# Altium schematic sheet MEM.SchDoc
size B
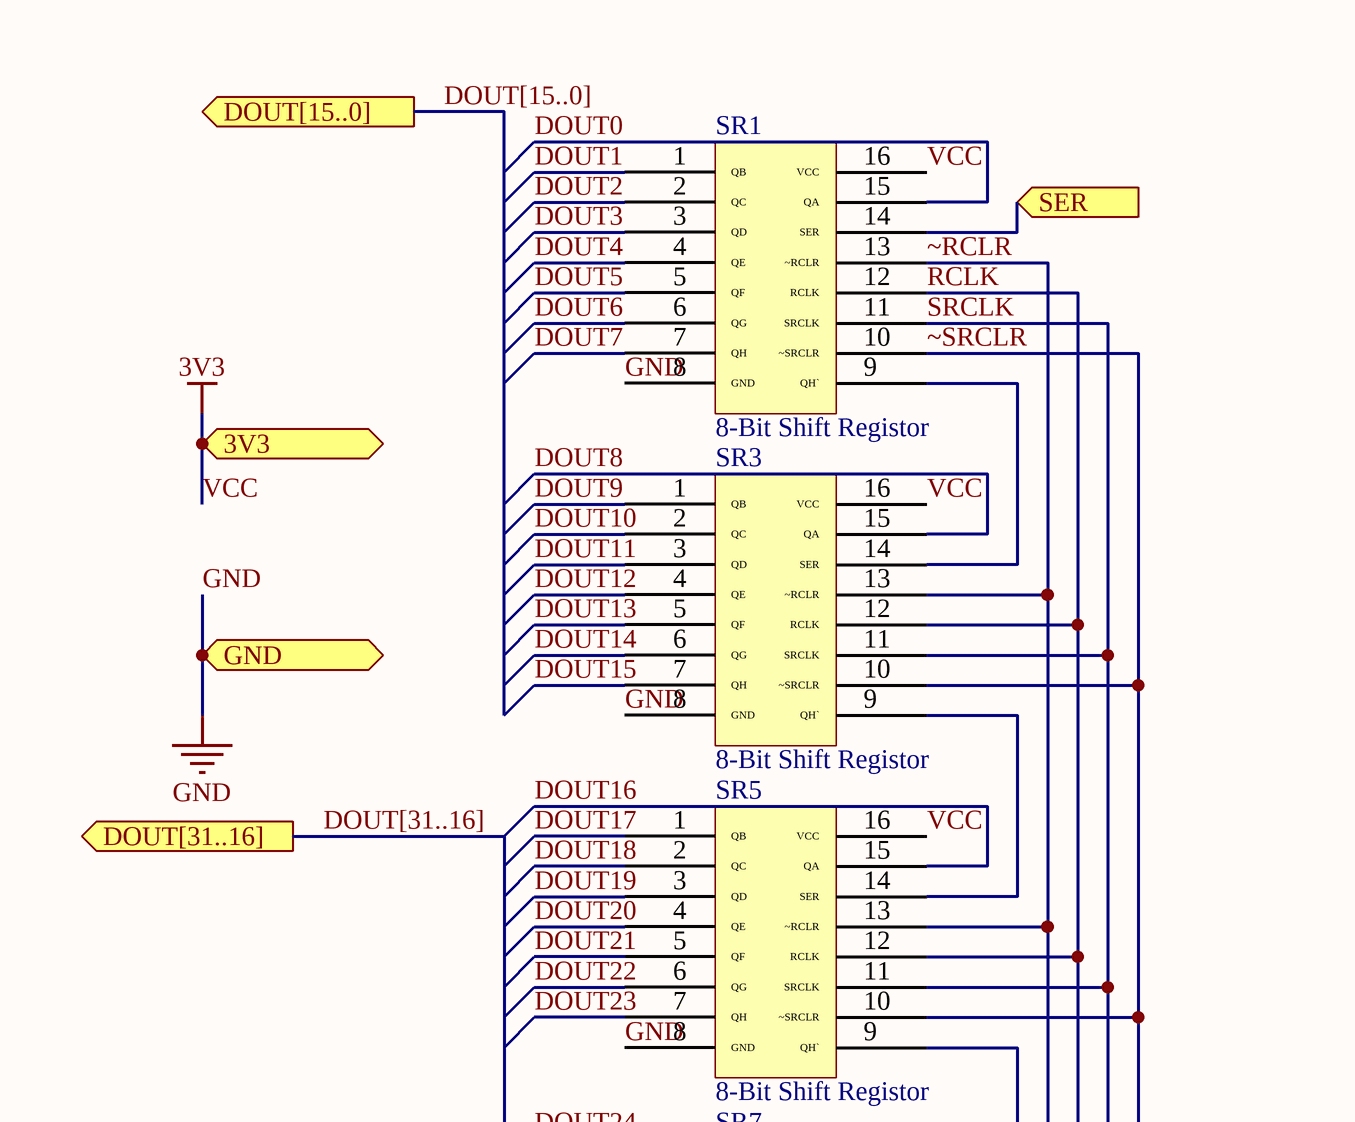
[diagram p0: MEM.SchDoc, top left]
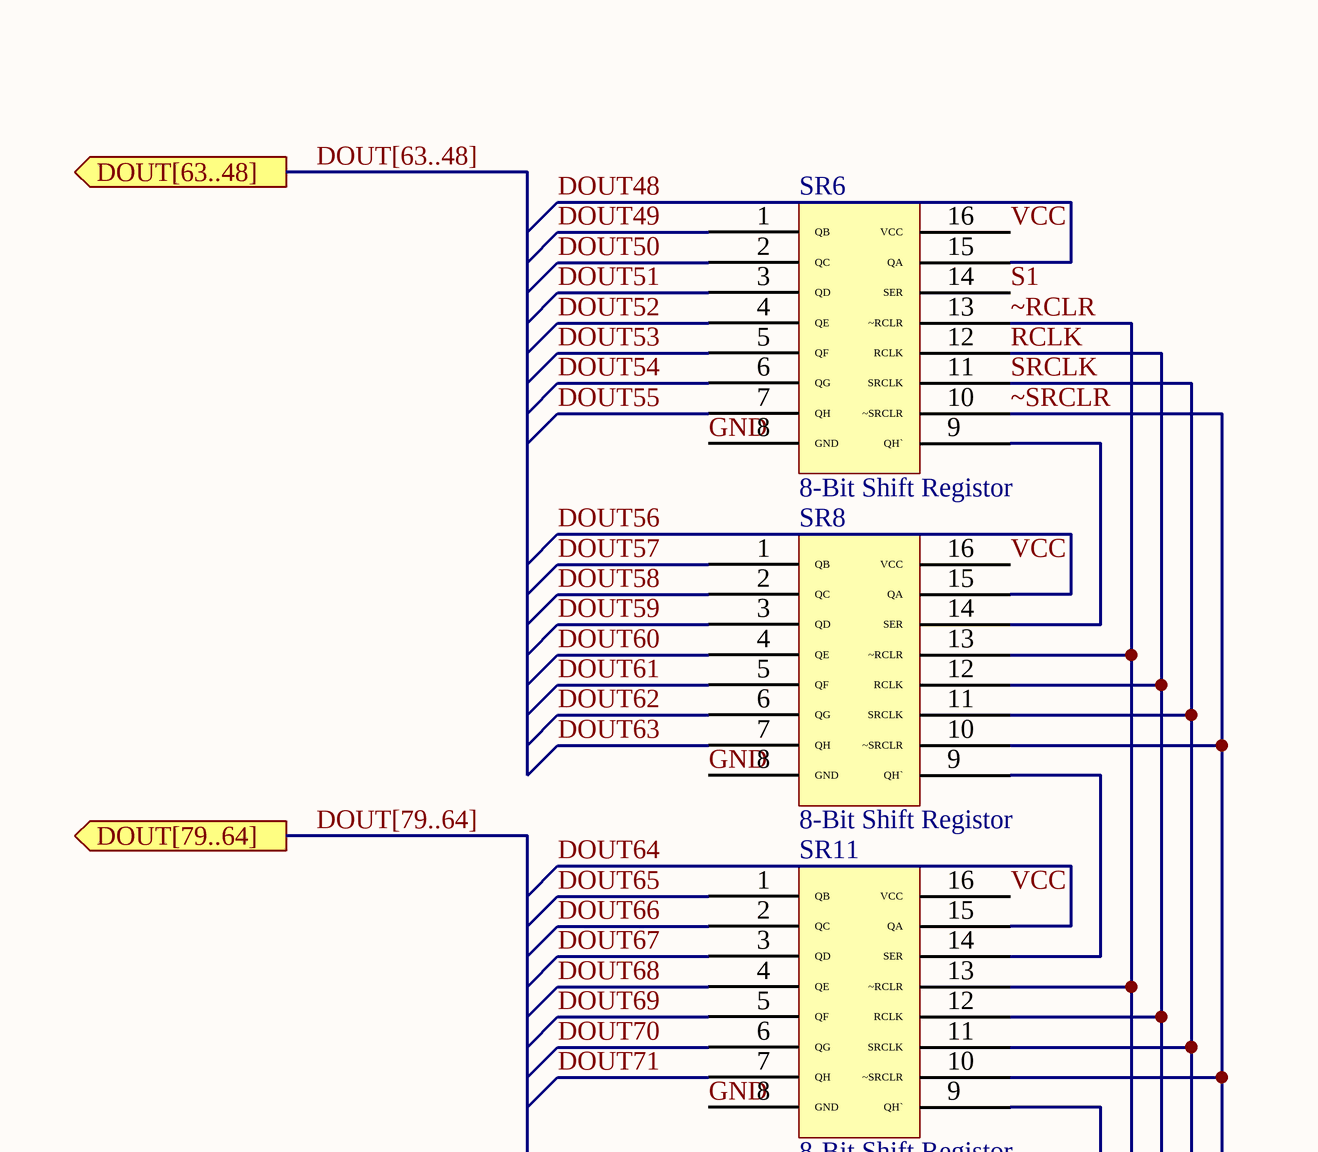
[diagram p1: MEM.SchDoc, top middle]
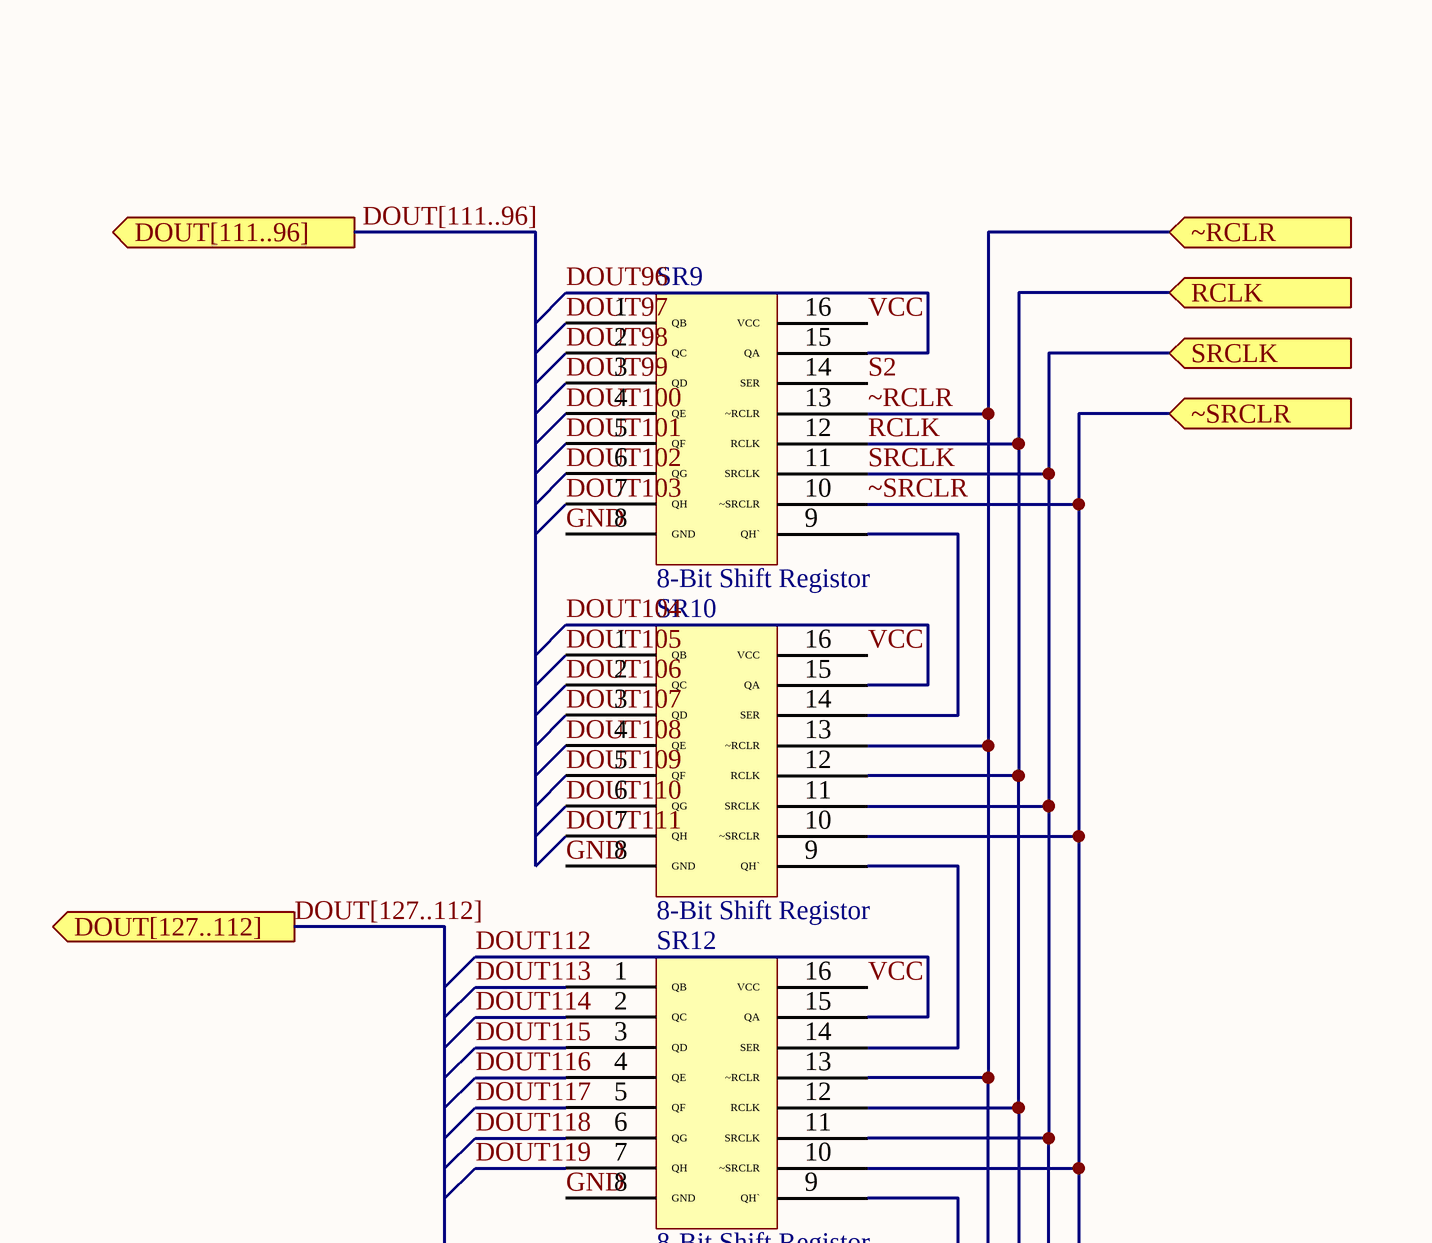
[diagram p2: MEM.SchDoc, top right]
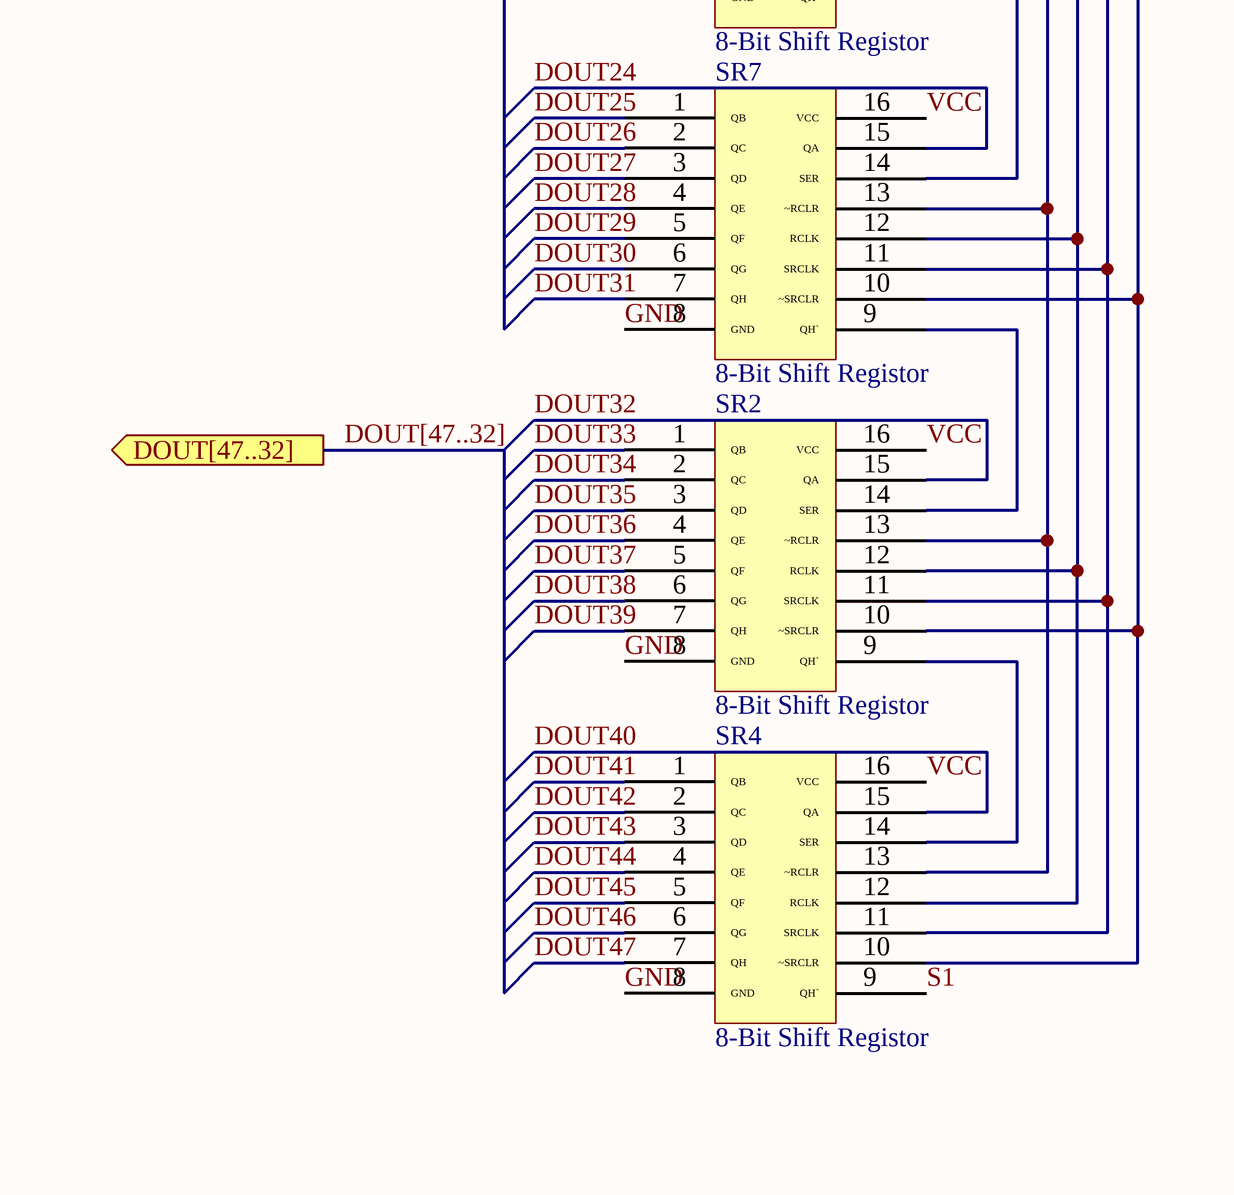
[diagram p3: MEM.SchDoc, bottom left]
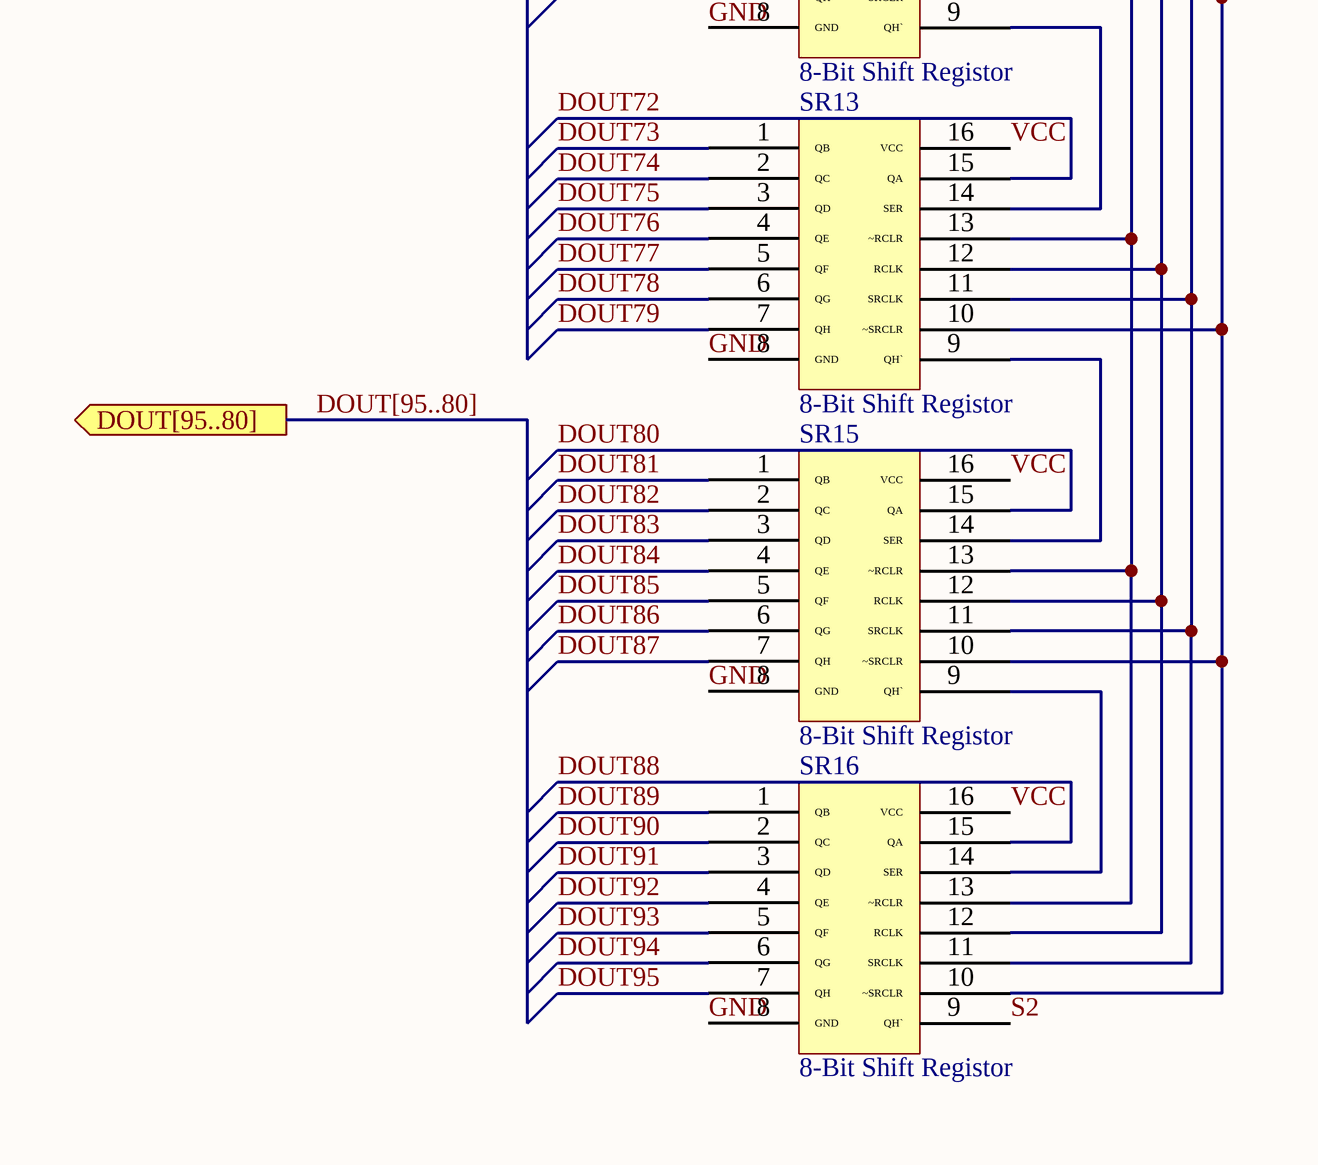
[diagram p4: MEM.SchDoc, bottom middle]
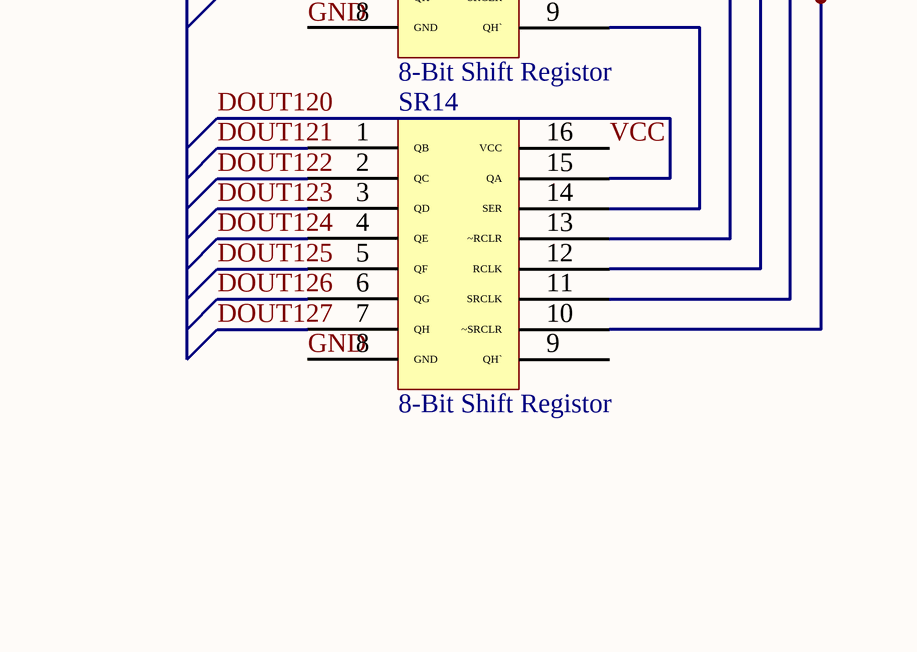
[diagram p5: MEM.SchDoc, bottom right]

## Parts
SR1  8-Bit Shift Registor
SR2  8-Bit Shift Registor
SR3  8-Bit Shift Registor
SR4  8-Bit Shift Registor
SR5  8-Bit Shift Registor
SR6  8-Bit Shift Registor
SR7  8-Bit Shift Registor
SR8  8-Bit Shift Registor
SR9  8-Bit Shift Registor
SR10  8-Bit Shift Registor
SR11  8-Bit Shift Registor
SR12  8-Bit Shift Registor
SR13  8-Bit Shift Registor
SR14  8-Bit Shift Registor
SR15  8-Bit Shift Registor
SR16  8-Bit Shift Registor

## Ports
3V3 (bidir), DOUT[15..0] (out), DOUT[31..16] (out), DOUT[47..32] (out), DOUT[63..48] (out), DOUT[79..64] (out), DOUT[95..80] (out), DOUT[111..96] (out), DOUT[127..112] (out), GND (bidir), RCLK (in), SER (in), SRCLK (in), ~RCLR (in), ~SRCLR (in)

## Nets
GND: SR1.8(GND) SR2.8(GND) SR3.8(GND) SR4.8(GND) SR5.8(GND) SR6.8(GND) SR7.8(GND) SR8.8(GND) SR9.8(GND) SR10.8(GND) SR11.8(GND) SR12.8(GND) SR13.8(GND) SR14.8(GND) SR15.8(GND) SR16.8(GND) ; port GND
VCC: SR1.16(VCC) SR2.16(VCC) SR3.16(VCC) SR4.16(VCC) SR5.16(VCC) SR6.16(VCC) SR7.16(VCC) SR8.16(VCC) SR9.16(VCC) SR10.16(VCC) SR11.16(VCC) SR12.16(VCC) SR13.16(VCC) SR14.16(VCC) SR15.16(VCC) SR16.16(VCC) ; port 3V3  [also labelled 3V3]
DOUT0: SR1.15(QA)
DOUT1: SR1.1(QB)
DOUT2: SR1.2(QC)
DOUT3: SR1.3(QD)
DOUT4: SR1.4(QE)
DOUT5: SR1.5(QF)
DOUT6: SR1.6(QG)
DOUT7: SR1.7(QH)
DOUT8: SR3.15(QA)
DOUT9: SR3.1(QB)
DOUT10: SR3.2(QC)
DOUT11: SR3.3(QD)
DOUT12: SR3.4(QE)
DOUT13: SR3.5(QF)
DOUT14: SR3.6(QG)
DOUT15: SR3.7(QH)
DOUT16: SR5.15(QA)
DOUT17: SR5.1(QB)
DOUT18: SR5.2(QC)
DOUT19: SR5.3(QD)
DOUT20: SR5.4(QE)
DOUT21: SR5.5(QF)
DOUT22: SR5.6(QG)
DOUT23: SR5.7(QH)
DOUT24: SR7.15(QA)
DOUT25: SR7.1(QB)
DOUT26: SR7.2(QC)
DOUT27: SR7.3(QD)
DOUT28: SR7.4(QE)
DOUT29: SR7.5(QF)
DOUT30: SR7.6(QG)
DOUT31: SR7.7(QH)
DOUT32: SR2.15(QA)
DOUT33: SR2.1(QB)
DOUT34: SR2.2(QC)
DOUT35: SR2.3(QD)
DOUT36: SR2.4(QE)
DOUT37: SR2.5(QF)
DOUT38: SR2.6(QG)
DOUT39: SR2.7(QH)
DOUT40: SR4.15(QA)
DOUT41: SR4.1(QB)
DOUT42: SR4.2(QC)
DOUT43: SR4.3(QD)
DOUT44: SR4.4(QE)
DOUT45: SR4.5(QF)
DOUT46: SR4.6(QG)
DOUT47: SR4.7(QH)
DOUT48: SR6.15(QA)
DOUT49: SR6.1(QB)
DOUT50: SR6.2(QC)
DOUT51: SR6.3(QD)
DOUT52: SR6.4(QE)
DOUT53: SR6.5(QF)
DOUT54: SR6.6(QG)
DOUT55: SR6.7(QH)
DOUT56: SR8.15(QA)
DOUT57: SR8.1(QB)
DOUT58: SR8.2(QC)
DOUT59: SR8.3(QD)
DOUT60: SR8.4(QE)
DOUT61: SR8.5(QF)
DOUT62: SR8.6(QG)
DOUT63: SR8.7(QH)
DOUT64: SR11.15(QA)
DOUT65: SR11.1(QB)
DOUT66: SR11.2(QC)
DOUT67: SR11.3(QD)
DOUT68: SR11.4(QE)
DOUT69: SR11.5(QF)
DOUT70: SR11.6(QG)
DOUT71: SR11.7(QH)
DOUT72: SR13.15(QA)
DOUT73: SR13.1(QB)
DOUT74: SR13.2(QC)
DOUT75: SR13.3(QD)
DOUT76: SR13.4(QE)
DOUT77: SR13.5(QF)
DOUT78: SR13.6(QG)
DOUT79: SR13.7(QH)
DOUT80: SR15.15(QA)
DOUT81: SR15.1(QB)
DOUT82: SR15.2(QC)
DOUT83: SR15.3(QD)
DOUT84: SR15.4(QE)
DOUT85: SR15.5(QF)
DOUT86: SR15.6(QG)
DOUT87: SR15.7(QH)
DOUT88: SR16.15(QA)
DOUT89: SR16.1(QB)
DOUT90: SR16.2(QC)
DOUT91: SR16.3(QD)
DOUT92: SR16.4(QE)
DOUT93: SR16.5(QF)
DOUT94: SR16.6(QG)
DOUT95: SR16.7(QH)
DOUT96: SR9.15(QA)
DOUT97: SR9.1(QB)
DOUT98: SR9.2(QC)
DOUT99: SR9.3(QD)
DOUT100: SR9.4(QE)
DOUT101: SR9.5(QF)
DOUT102: SR9.6(QG)
DOUT103: SR9.7(QH)
DOUT104: SR10.15(QA)
DOUT105: SR10.1(QB)
DOUT106: SR10.2(QC)
DOUT107: SR10.3(QD)
DOUT108: SR10.4(QE)
DOUT109: SR10.5(QF)
DOUT110: SR10.6(QG)
DOUT111: SR10.7(QH)
DOUT112: SR12.15(QA)
DOUT113: SR12.1(QB)
DOUT114: SR12.2(QC)
DOUT115: SR12.3(QD)
DOUT116: SR12.4(QE)
DOUT117: SR12.5(QF)
DOUT118: SR12.6(QG)
DOUT119: SR12.7(QH)
DOUT120: SR14.15(QA)
DOUT121: SR14.1(QB)
DOUT122: SR14.2(QC)
DOUT123: SR14.3(QD)
DOUT124: SR14.4(QE)
DOUT125: SR14.5(QF)
DOUT126: SR14.6(QG)
DOUT127: SR14.7(QH)
RCLK: SR1.12(RCLK) SR2.12(RCLK) SR3.12(RCLK) SR4.12(RCLK) SR5.12(RCLK) SR6.12(RCLK) SR7.12(RCLK) SR8.12(RCLK) SR9.12(RCLK) SR10.12(RCLK) SR11.12(RCLK) SR12.12(RCLK) SR13.12(RCLK) SR14.12(RCLK) SR15.12(RCLK) SR16.12(RCLK) ; port RCLK
S1: SR4.9(QH`) SR6.14(SER)
S2: SR9.14(SER) SR16.9(QH`)
SER: SR1.14(SER) ; port SER
SRCLK: SR1.11(SRCLK) SR2.11(SRCLK) SR3.11(SRCLK) SR4.11(SRCLK) SR5.11(SRCLK) SR6.11(SRCLK) SR7.11(SRCLK) SR8.11(SRCLK) SR9.11(SRCLK) SR10.11(SRCLK) SR11.11(SRCLK) SR12.11(SRCLK) SR13.11(SRCLK) SR14.11(SRCLK) SR15.11(SRCLK) SR16.11(SRCLK) ; port SRCLK
~RCLR: SR1.13(~RCLR) SR2.13(~RCLR) SR3.13(~RCLR) SR4.13(~RCLR) SR5.13(~RCLR) SR6.13(~RCLR) SR7.13(~RCLR) SR8.13(~RCLR) SR9.13(~RCLR) SR10.13(~RCLR) SR11.13(~RCLR) SR12.13(~RCLR) SR13.13(~RCLR) SR14.13(~RCLR) SR15.13(~RCLR) SR16.13(~RCLR) ; port ~RCLR
~SRCLR: SR1.10(~SRCLR) SR2.10(~SRCLR) SR3.10(~SRCLR) SR4.10(~SRCLR) SR5.10(~SRCLR) SR6.10(~SRCLR) SR7.10(~SRCLR) SR8.10(~SRCLR) SR9.10(~SRCLR) SR10.10(~SRCLR) SR11.10(~SRCLR) SR12.10(~SRCLR) SR13.10(~SRCLR) SR14.10(~SRCLR) SR15.10(~SRCLR) SR16.10(~SRCLR) ; port ~SRCLR
NetSR1_9: SR1.9(QH`) SR3.14(SER)
NetSR2_9: SR2.9(QH`) SR4.14(SER)
NetSR2_14: SR2.14(SER) SR7.9(QH`)
NetSR3_9: SR3.9(QH`) SR5.14(SER)
NetSR5_9: SR5.9(QH`) SR7.14(SER)
NetSR6_9: SR6.9(QH`) SR8.14(SER)
NetSR8_9: SR8.9(QH`) SR11.14(SER)
NetSR9_9: SR9.9(QH`) SR10.14(SER)
NetSR10_9: SR10.9(QH`) SR12.14(SER)
NetSR11_9: SR11.9(QH`) SR13.14(SER)
NetSR12_9: SR12.9(QH`) SR14.14(SER)
NetSR13_9: SR13.9(QH`) SR15.14(SER)
NetSR15_9: SR15.9(QH`) SR16.14(SER)

Not connected (* = marked no-connect by the designer): SR14 9(QH`)

## Buses and harness runs
bus DOUT[15..0] = port DOUT[15..0]
bus DOUT[31..16] = port DOUT[31..16]
bus DOUT[47..32] = port DOUT[47..32]
bus DOUT[63..48] = port DOUT[63..48]
bus DOUT[79..64] = port DOUT[79..64]
bus DOUT[95..80] = port DOUT[95..80]
bus DOUT[111..96] = port DOUT[111..96]
bus DOUT[127..112] = port DOUT[127..112]

## Library data of the parts
SR1-SR16 = 8-Bit Shift Registor: Supplier 1: Digi-Key; Supplier Part Number 1: 296-4767-6-ND